# EAGLE design OptoOutput (EAGLE 7.2.0)
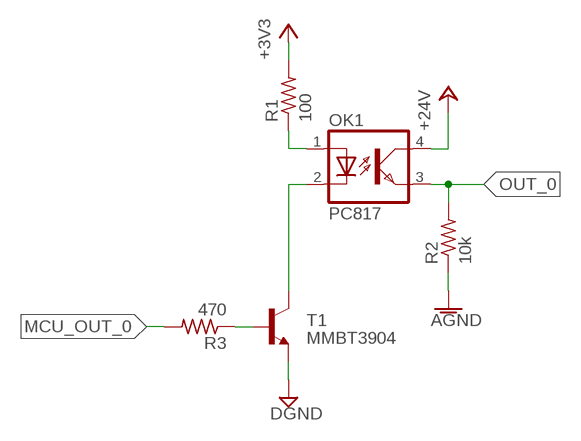
[diagram p0: schematic, sheet 1]

## Parts
OK1  PC817  [DIL04]
R1  100  R-US_R0402  [R0402]
R2  10k  R-US_R0402  [R0402]
R3  470  R-US_0204/5  [0204/5]
T1  MMBT3904  MMBT3904LT1-NPN-SOT23-BEC  [SOT23-BEC]

## Nets
+3V3: R1.2
+24V: OK1.4(COL)
AGND: R2.1
DGND: T1.E
MCU_OUT_0: R3.2
N$1: OK1.2(C) T1.C
N$3: R3.1 T1.B
N$4: OK1.1(A) R1.1
OUT_0: OK1.3(EMIT) R2.2

## Library data of the parts
OK1 = optocoupler:PC817: SHARP OPTO COUPLER; MPN: PC817X4J000F; OC_FARNELL: 9707727; OC_NEWARK: 97K7059
R1-R3 = rcl:R-US_: RESISTOR, American symbol
T1 = transistor:*-NPN-: NPN Transistror BF959 corrected 2008.03.06

## Board
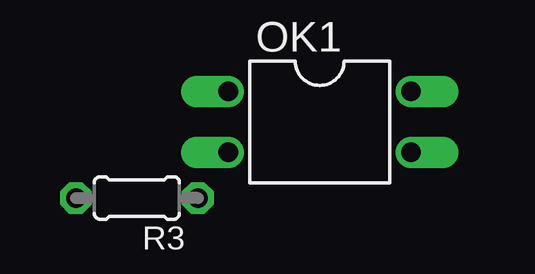
[diagram p1: board, top side]
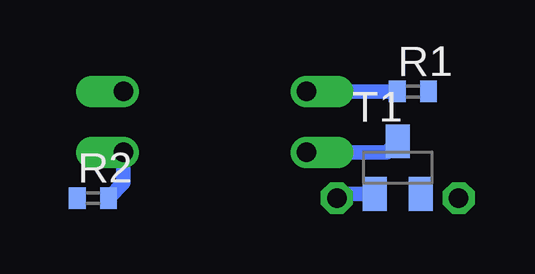
[diagram p2: board, bottom side, seen from below]

No outline drawn. Coordinates in mm, seen from the top.
Copper layers (1*16): Top 0.035mm / dielectric 1.5mm / Bottom 0.035mm
Design rules "default": minimum track width 10mil, minimum drill 24mil, track to track 8mil, track to pad 8mil, pad to pad 8mil, via to via 8mil, smd to smd 8mil, copper to edge 40mil, drill to drill 8mil, minimum pad ring 10mil, minimum via ring 8mil, stop-mask expansion 4mil, vias tented up to drill 0mil, thermal gap 10mil

### Footprints (pad centres in the part's own frame; a part is rotated, then mirrored left to right if it is on the bottom)
DIL04 = drill 0.813 offset: 1 -1.27,-3.81; 2 1.27,-3.81; 3 1.27,3.81; 4 -1.27,3.81
R0402 = smd 0.7 x 0.9: 1 -0.65,0; 2 0.65,0
0204/5 = drill 0.813 octagon: 1 -2.54,0; 2 2.54,0
SOT23-BEC = smd 1 x 1.4: B -0.95,-1.1; C 0,1.1; E 0.95,-1.1

### Placement (x,y rotation side)
OK1  0,0 270 top
R1  -8.26,1.27 0 bottom
R2  5.08,-3.17 0 bottom
R3  -7.62,-3.17 180 top
T1  -7.62,-1.91 0 bottom

### Tracks (layer width: path | path; a pad name or v marks a point on that pad's centre or on a via)
N$1
  Bottom 0.61: OK1.2 -7.16,-1.27 T1.C
N$3
  Bottom 0.61: T1.B -5.25,-3 R3.1
N$4
  Bottom 0.61: R1.1 OK1.1
OUT_0
  Bottom 0.61: OK1.3 3.81,-2.56 R2.2